# EAGLE schematic signal_distribution_board (EAGLE 9.6.2)
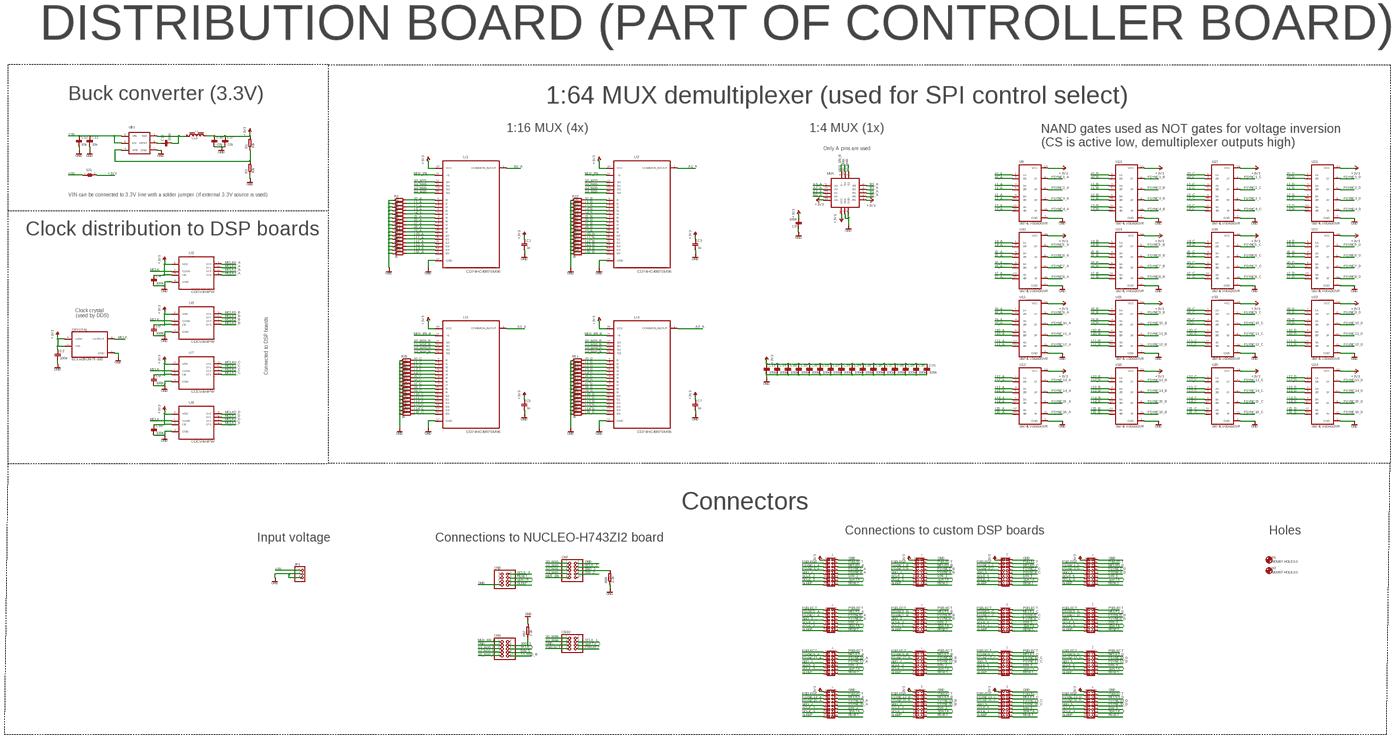
[diagram p0: schematic, sheet 1, overview]
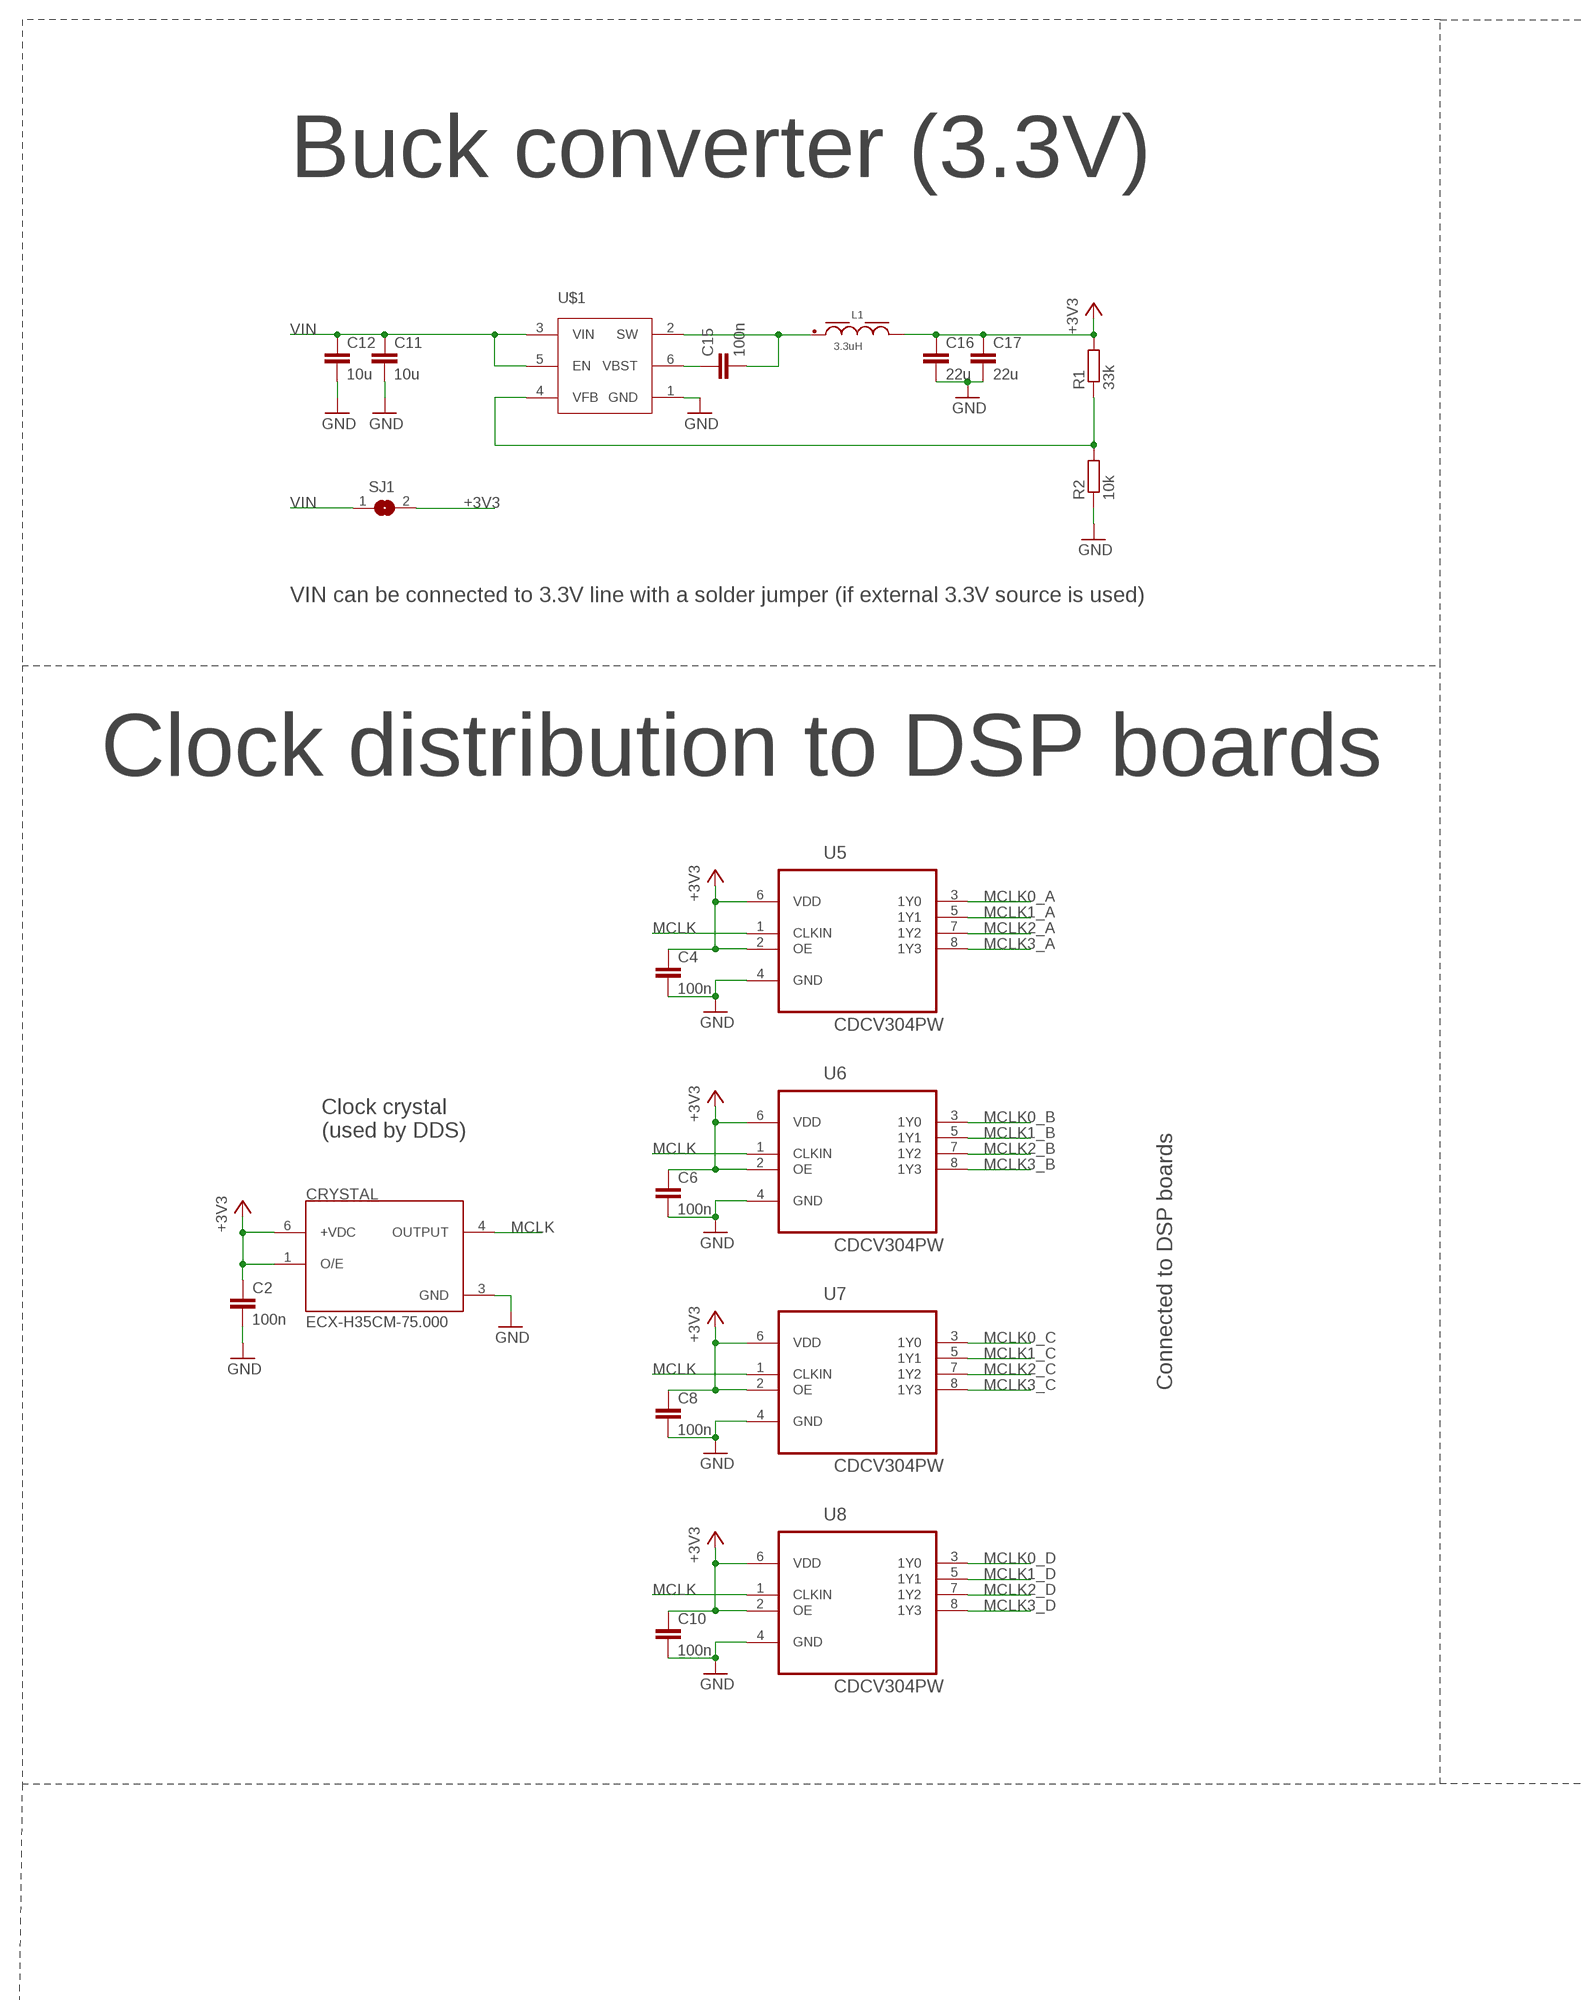
[diagram p1: schematic, sheet 1, part 1 of 8]
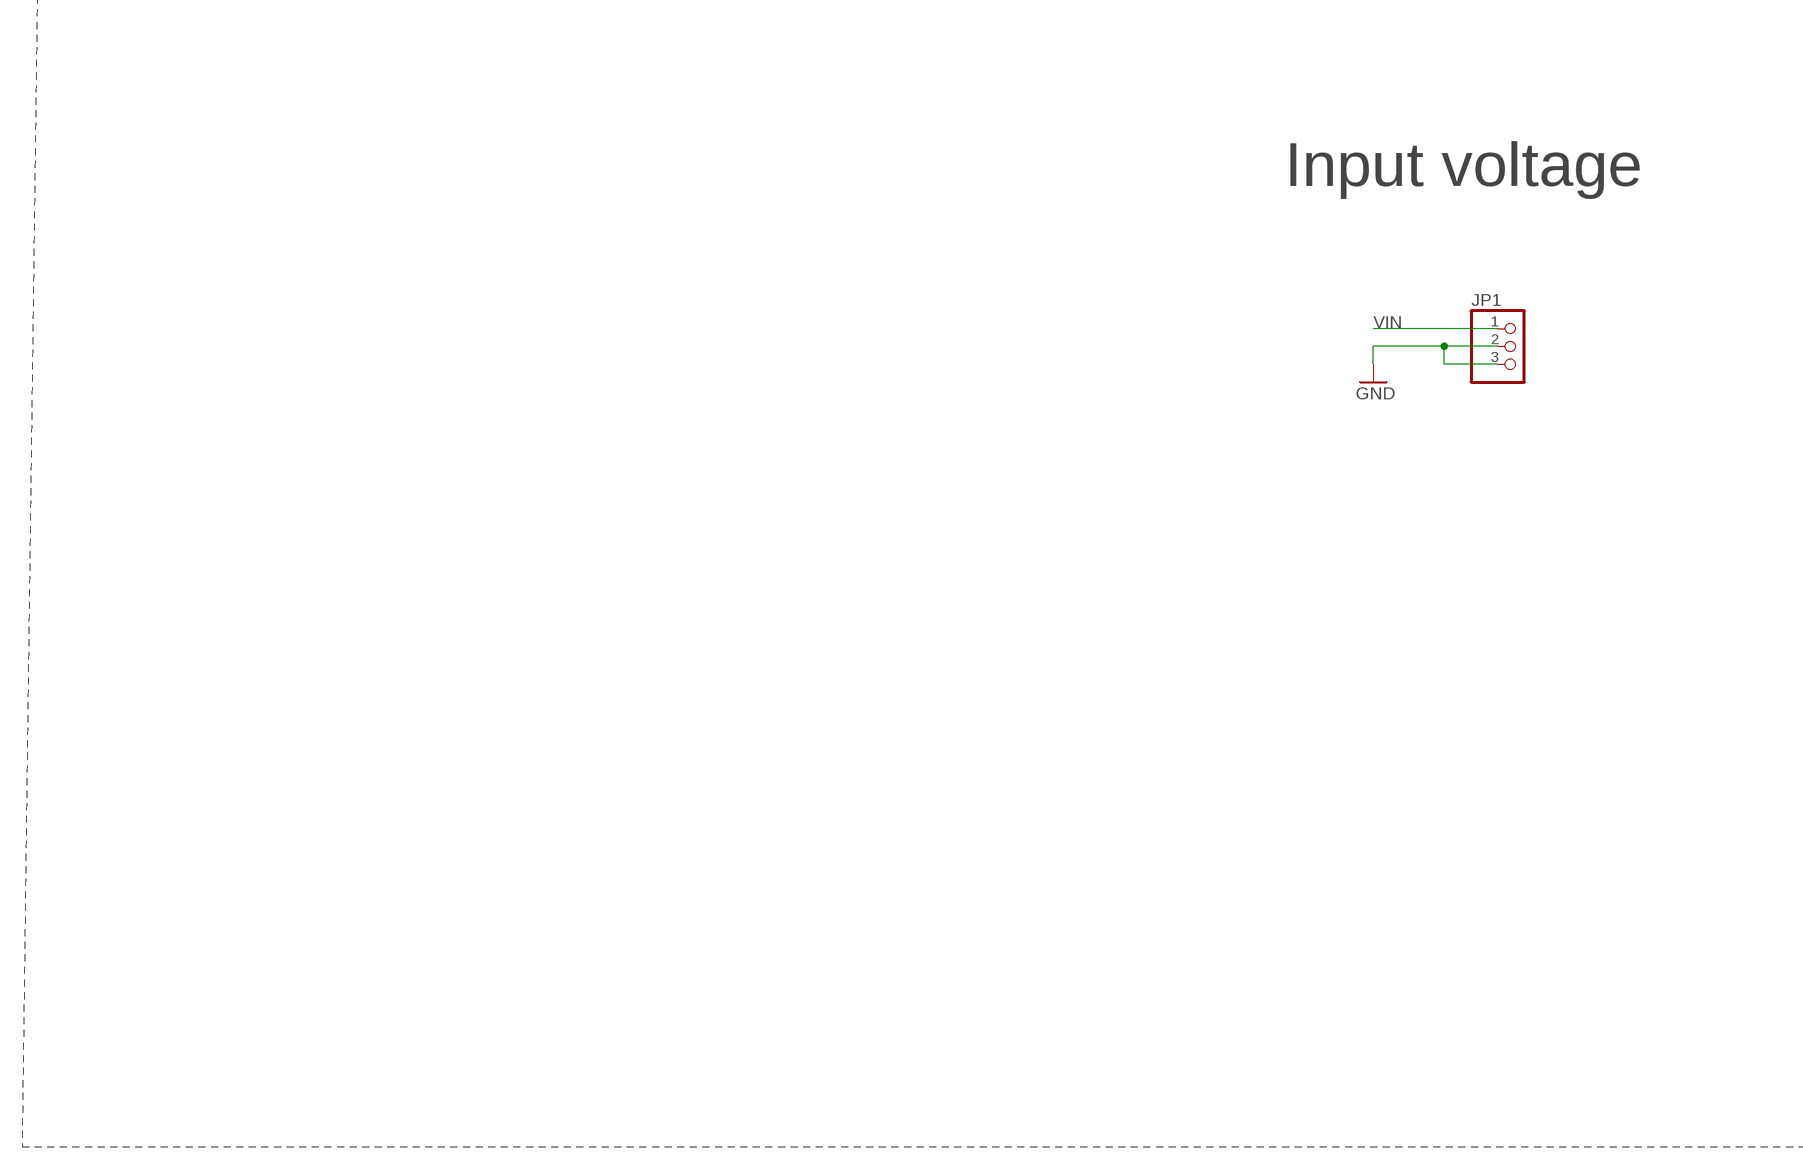
[diagram p2: schematic, sheet 1, part 2 of 8]
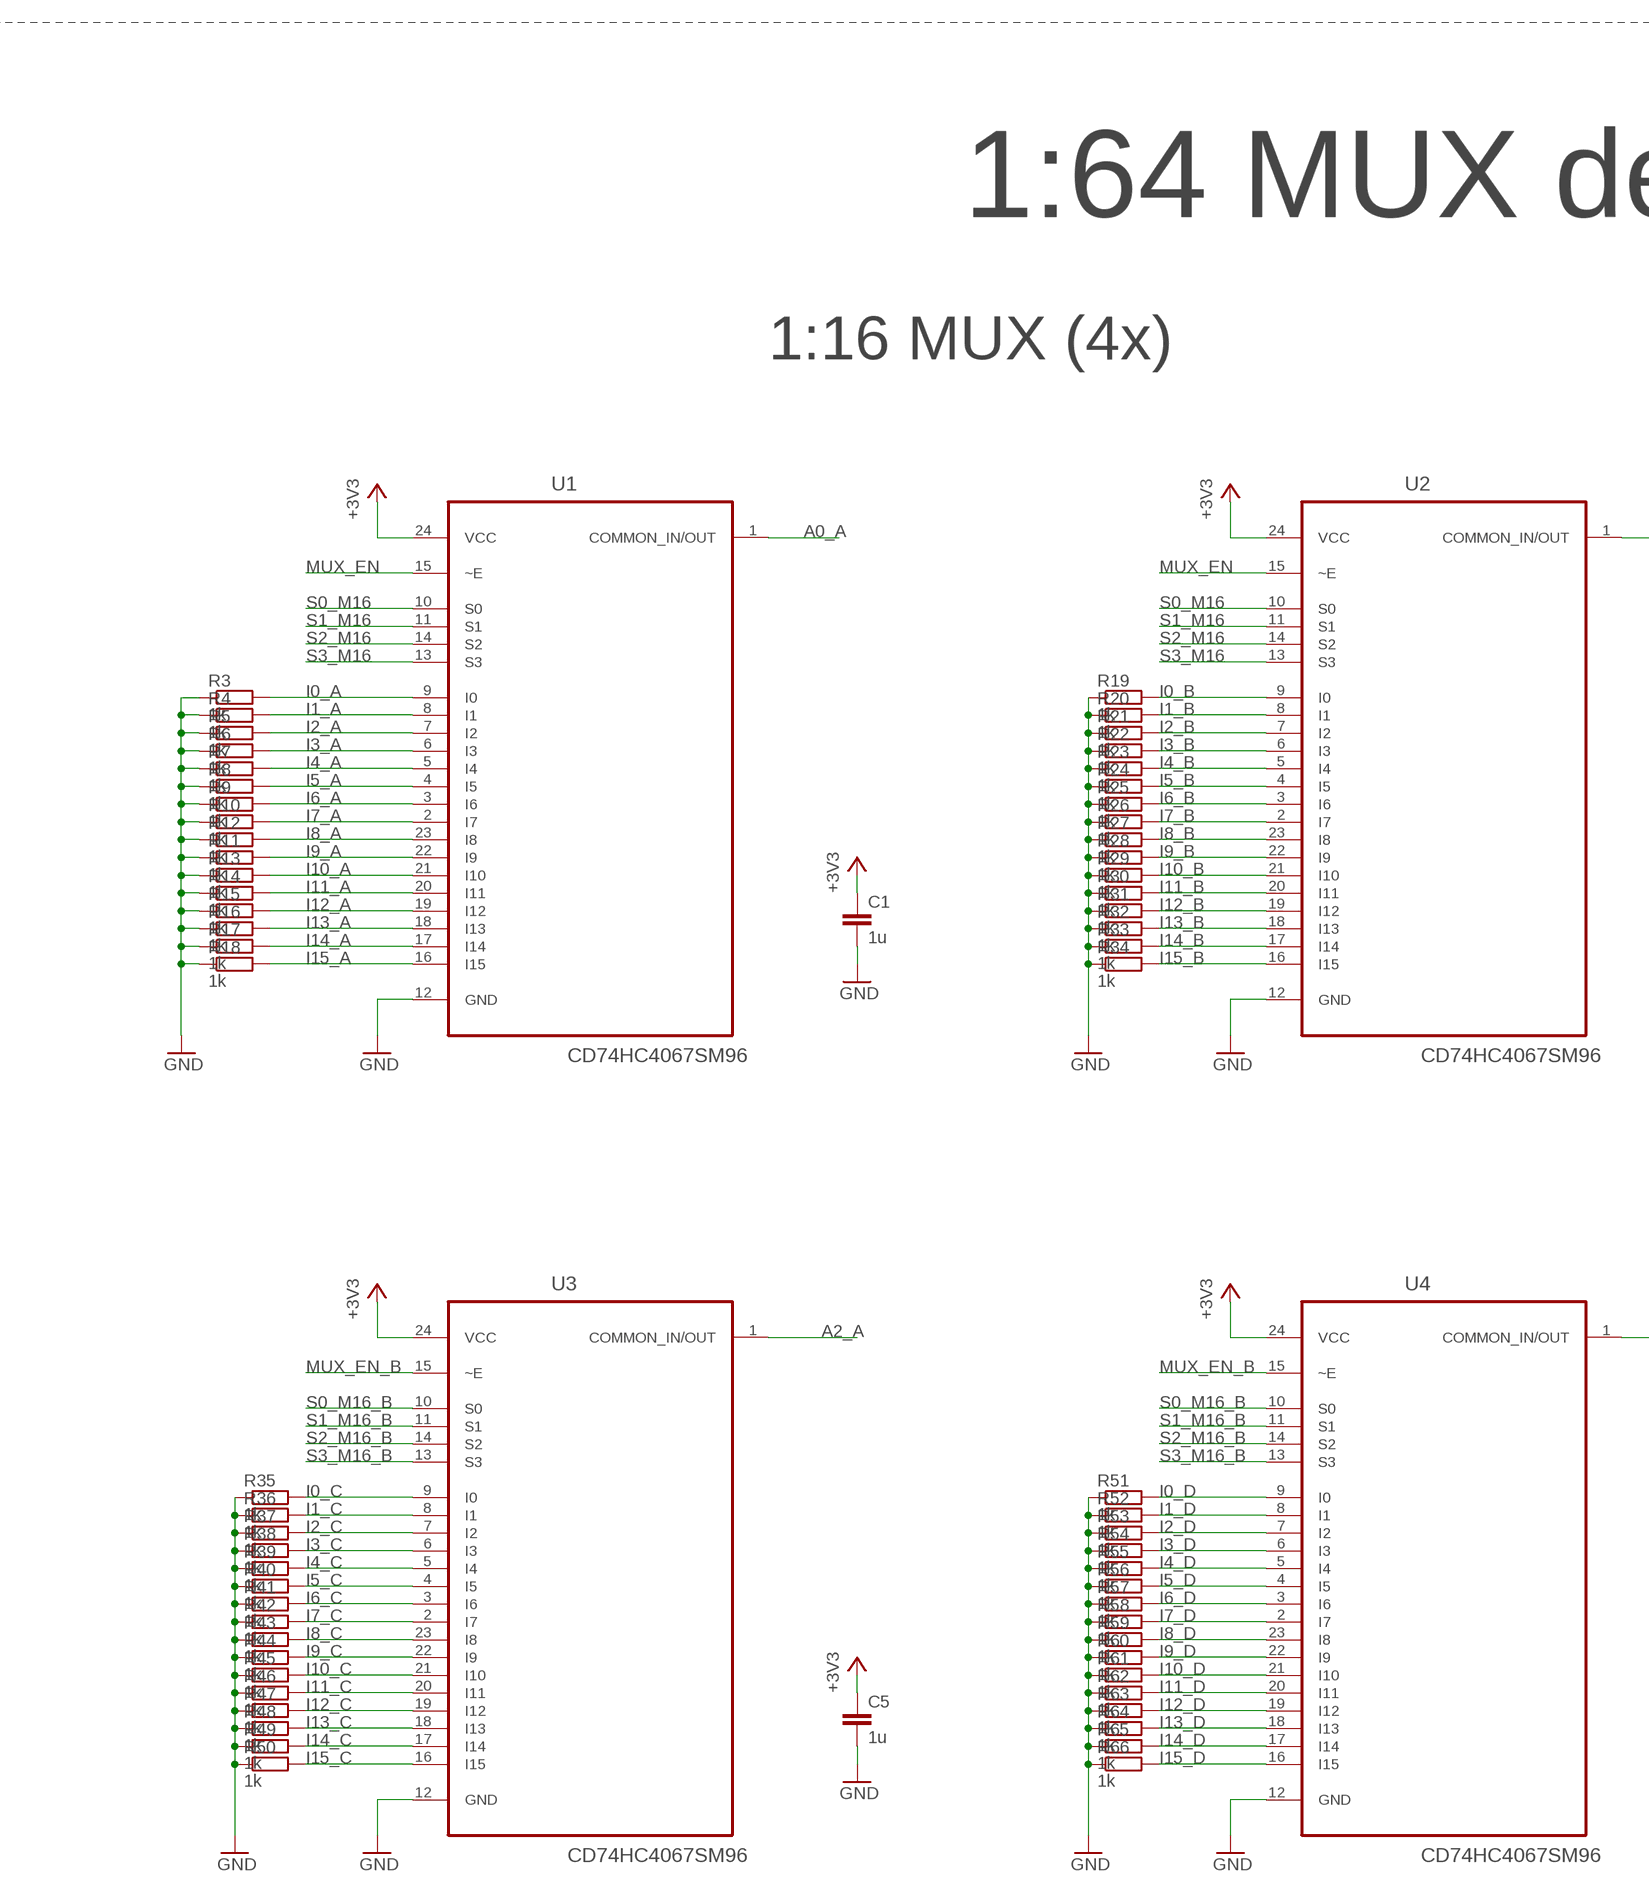
[diagram p3: schematic, sheet 1, part 3 of 8]
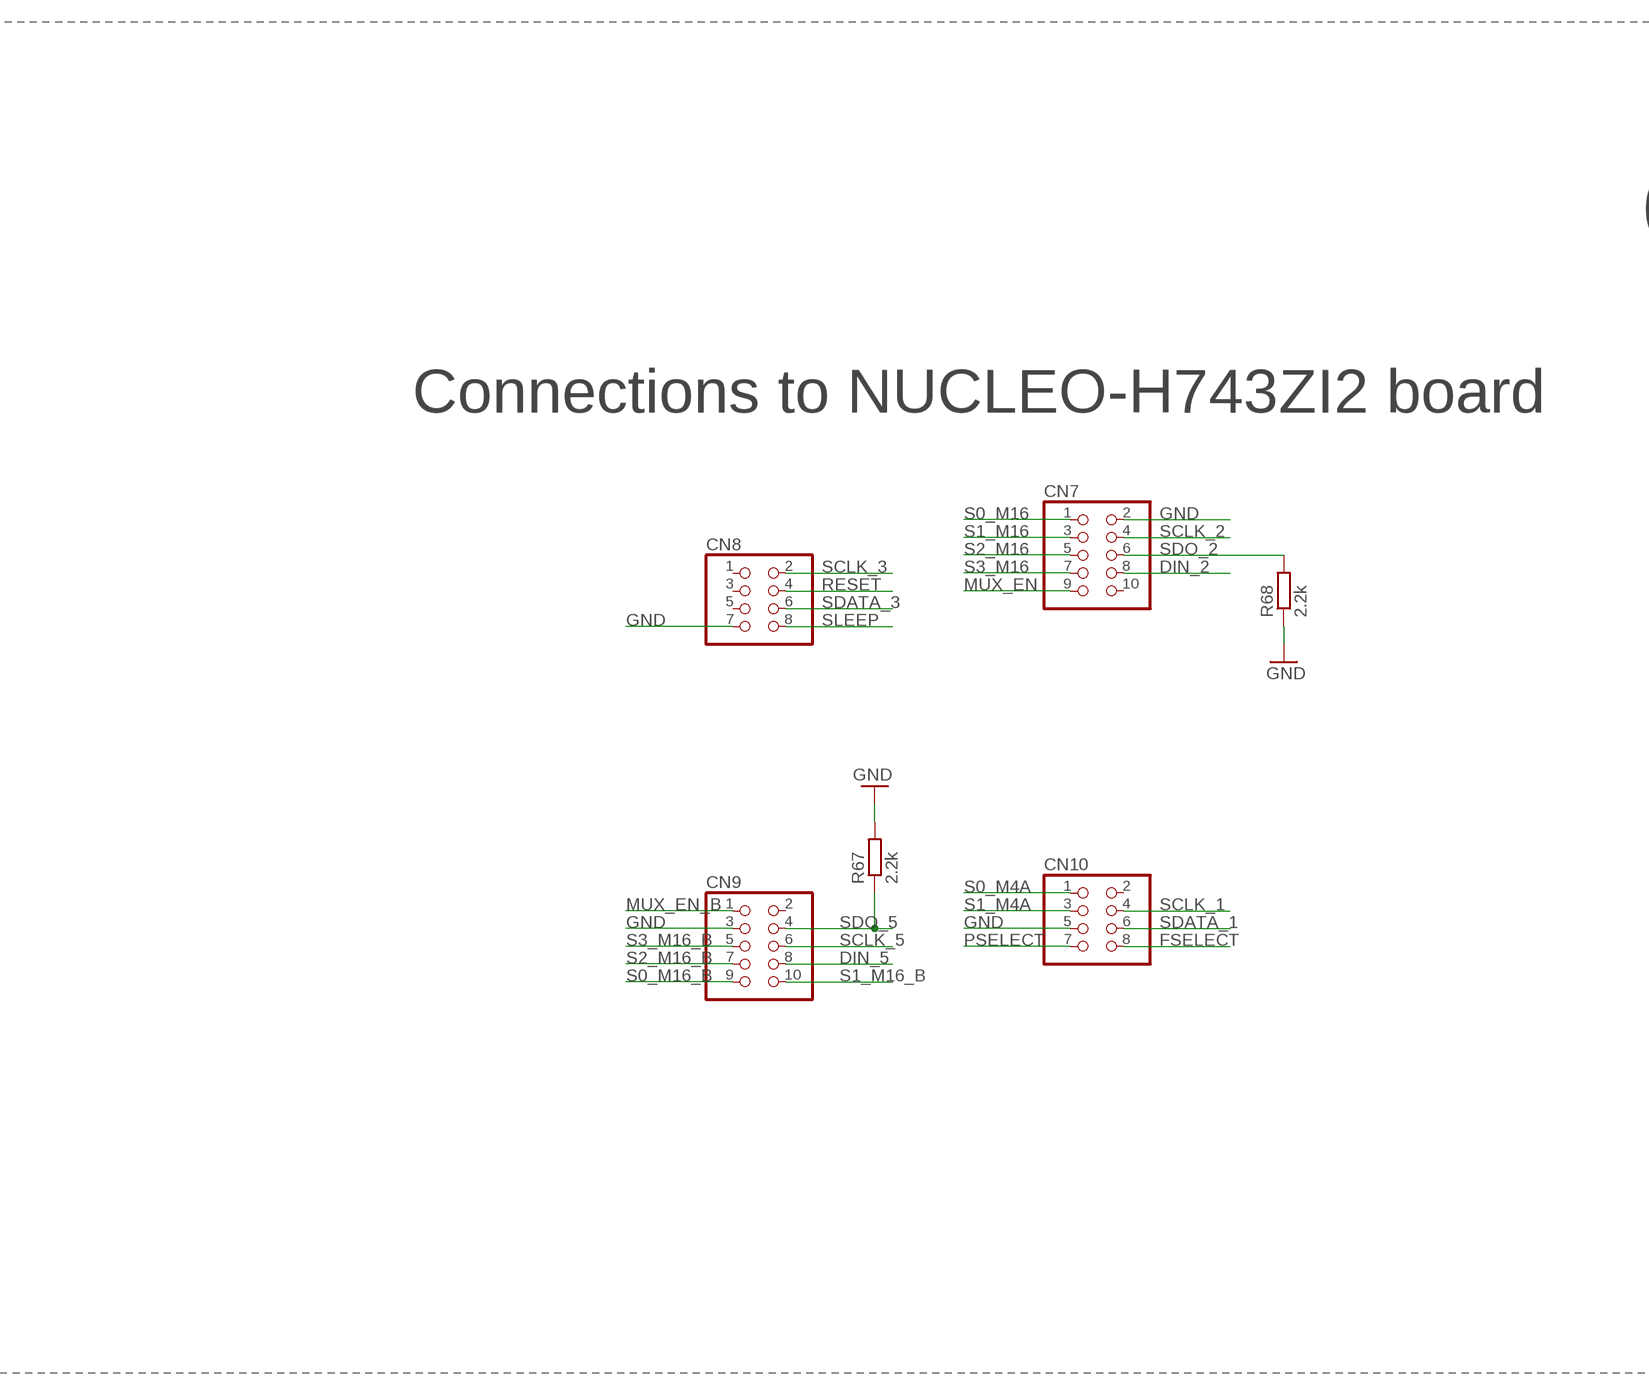
[diagram p4: schematic, sheet 1, part 4 of 8]
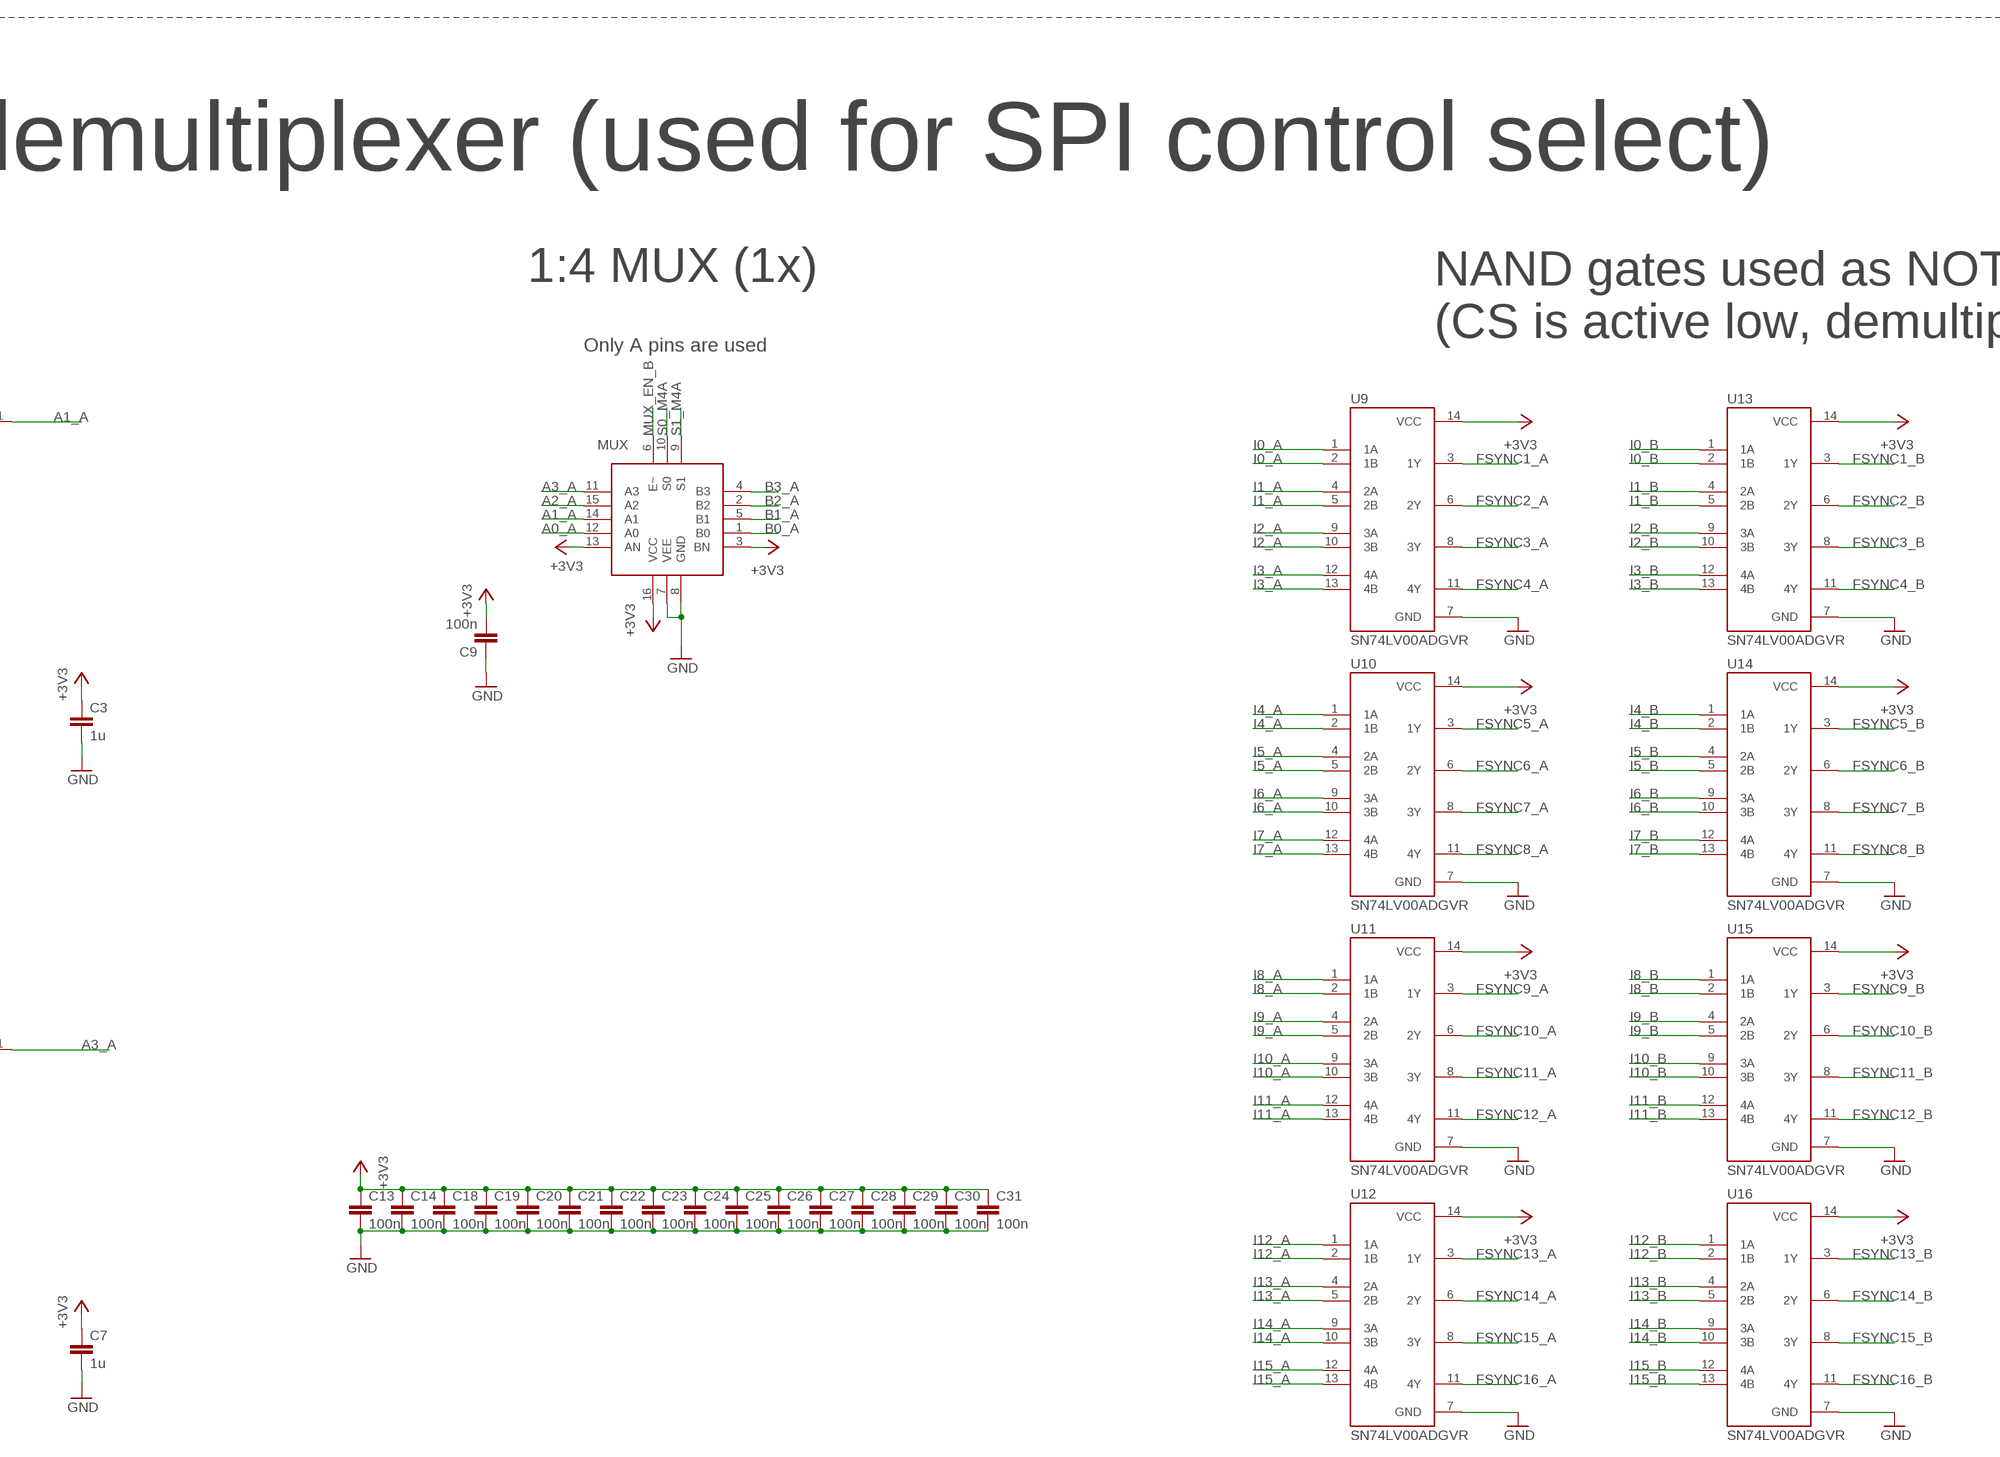
[diagram p5: schematic, sheet 1, part 5 of 8]
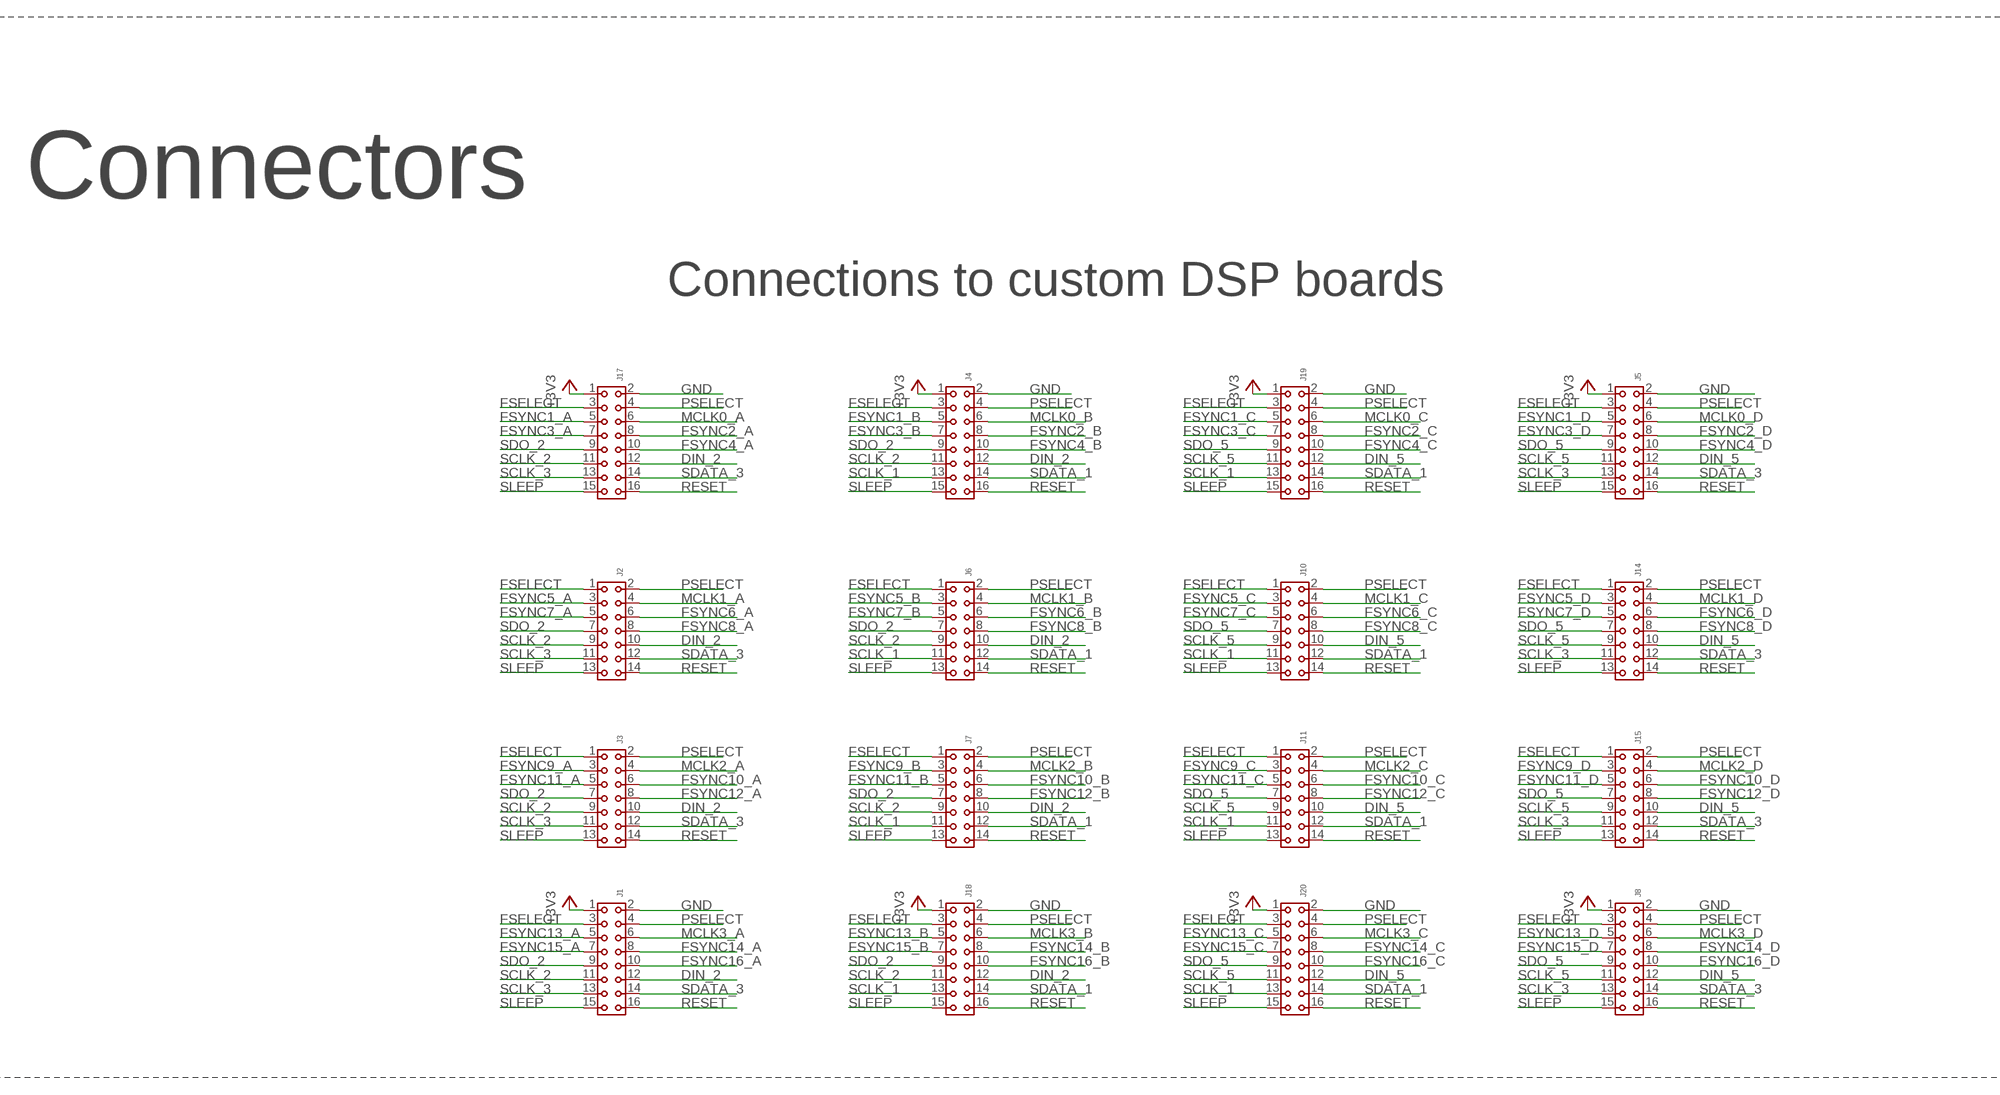
[diagram p6: schematic, sheet 1, part 6 of 8]
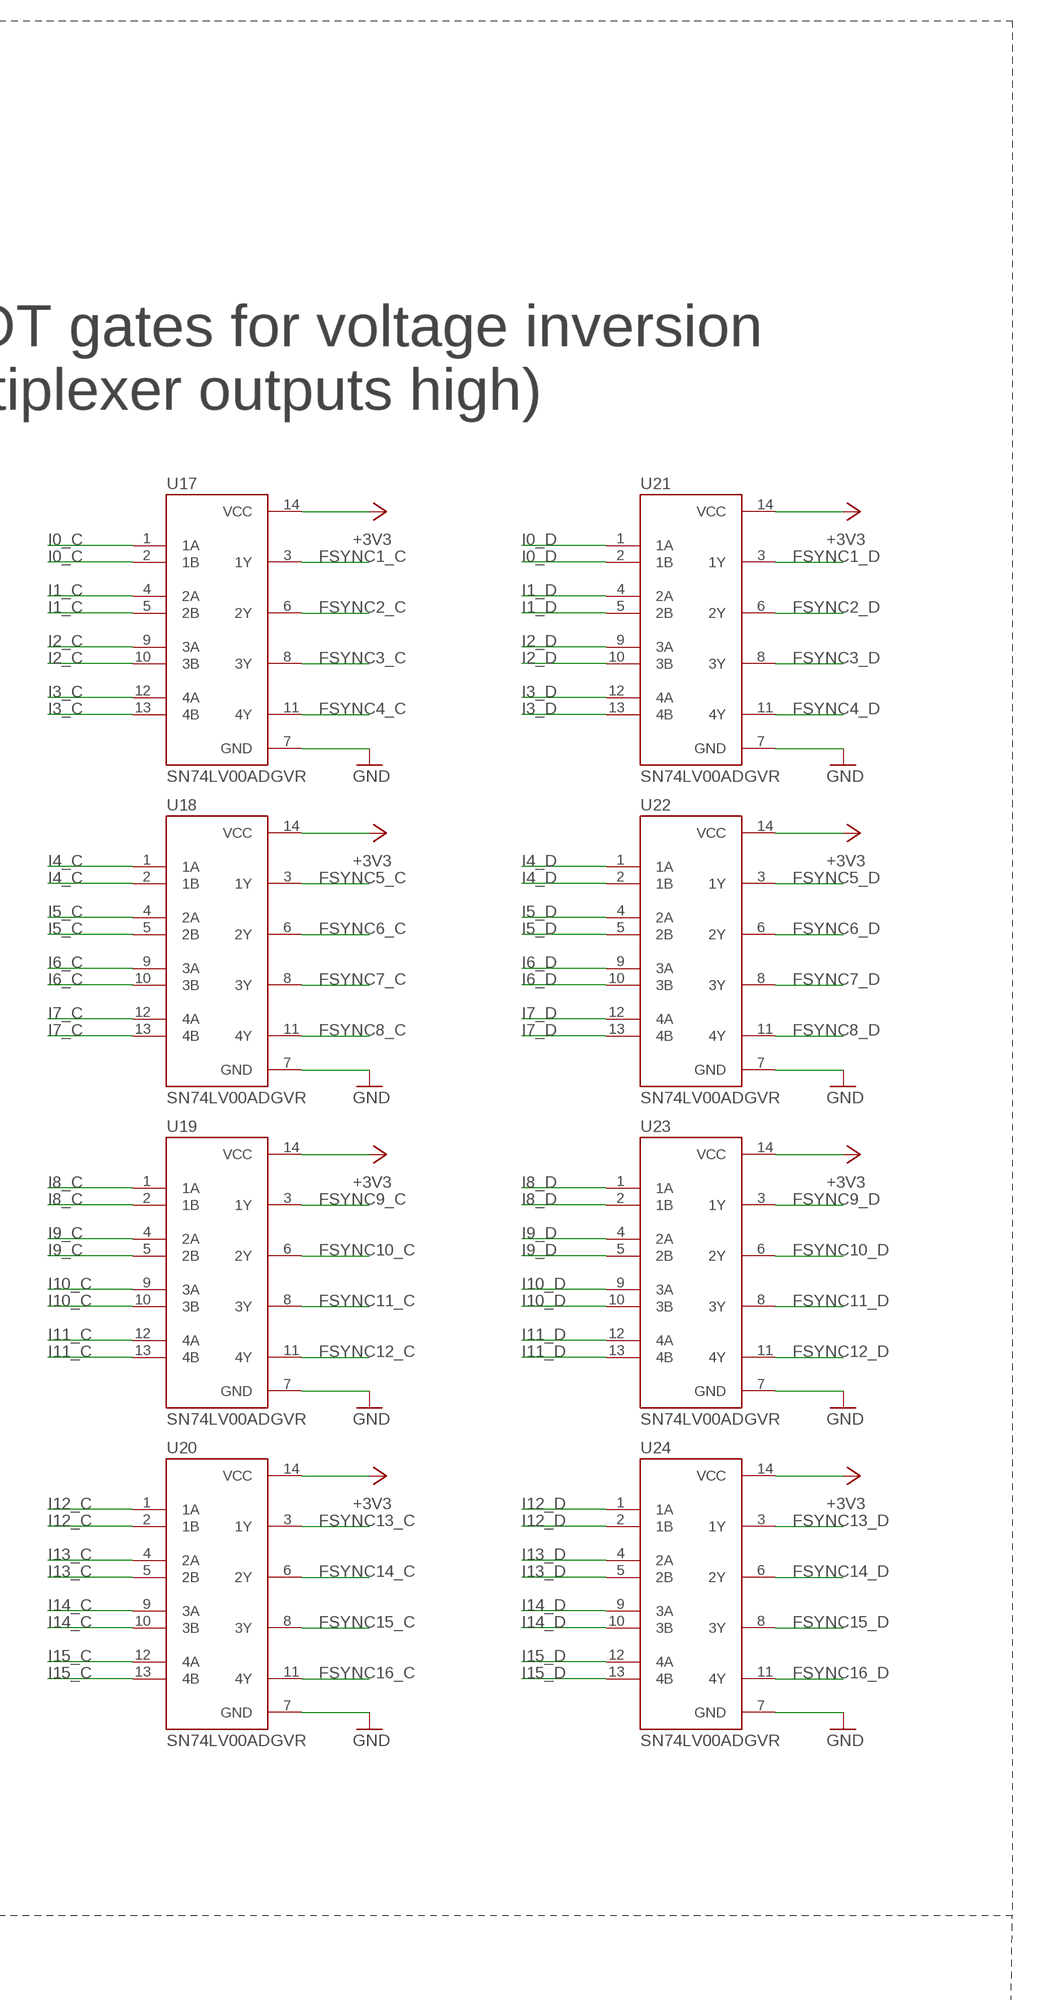
[diagram p7: schematic, sheet 1, part 7 of 8]
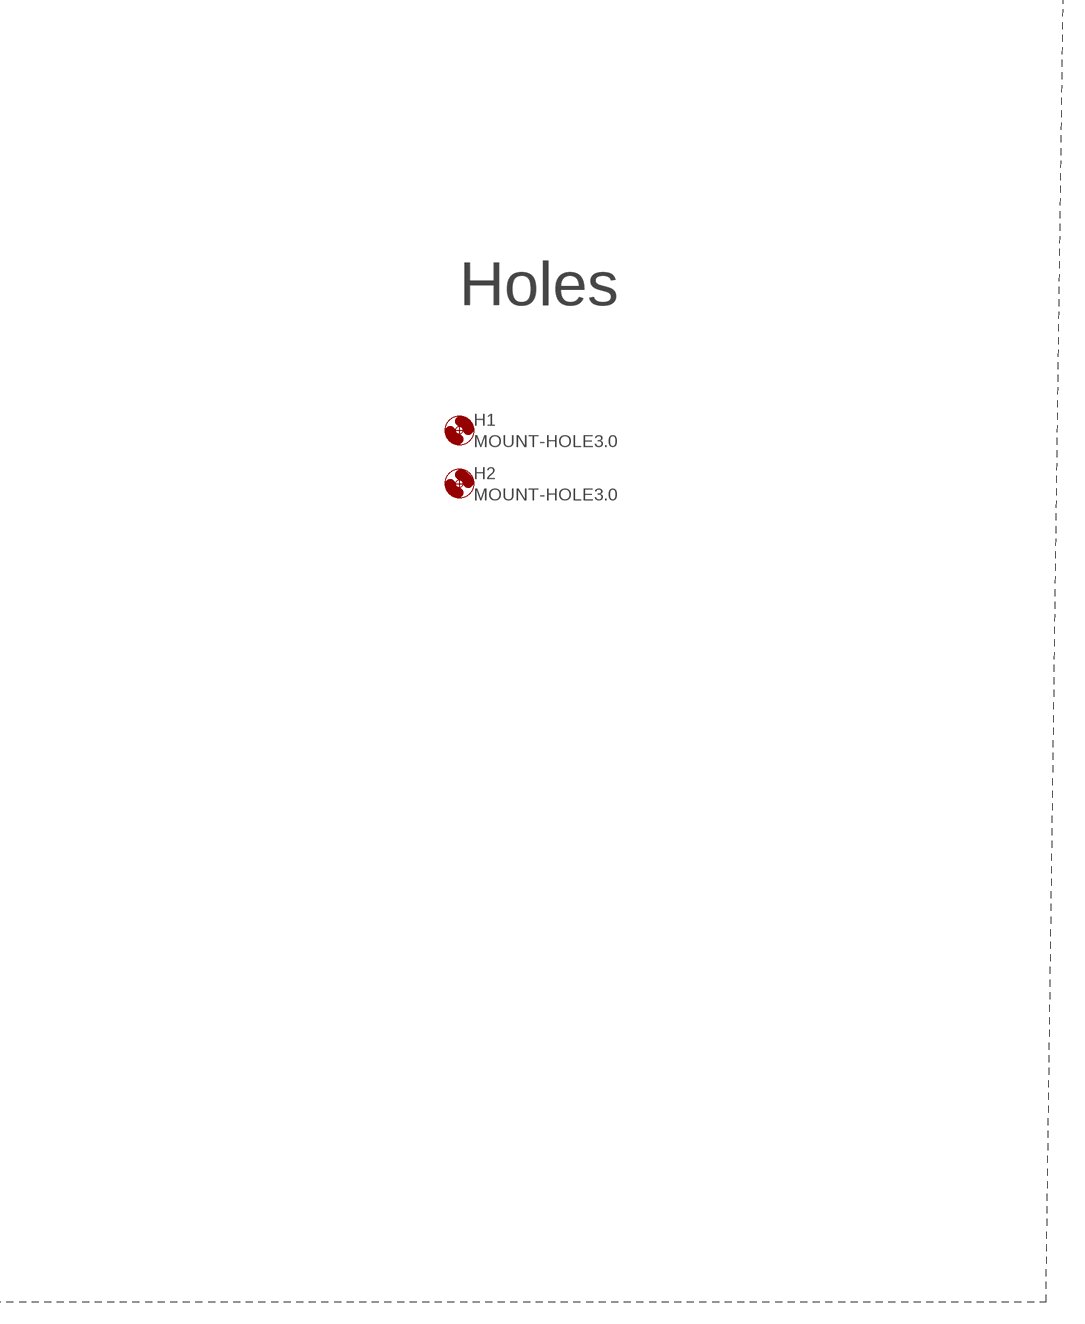
[diagram p8: schematic, sheet 1, part 8 of 8]

## Parts
C1  1u  C-EUC0603  [C0603]
C2  100n  C-EUC0603  [C0603]
C3  1u  C-EUC0603  [C0603]
C4  100n  C-EUC0603  [C0603]
C5  1u  C-EUC0603  [C0603]
C6  100n  C-EUC0603  [C0603]
C7  1u  C-EUC0603  [C0603]
C8  100n  C-EUC0603  [C0603]
C9  100n  C-EUC0603  [C0603]
C10  100n  C-EUC0603  [C0603]
C11  10u  C-EUC0805  [C0805]
C12  10u  C-EUC0805  [C0805]
C13  100n  C-EUC0603  [C0603]
C14  100n  C-EUC0603  [C0603]
C15  100n  C-EUC0603  [C0603]
C16  22u  C-EUC1206  [C1206]
C17  22u  C-EUC1206  [C1206]
C18  100n  C-EUC0603  [C0603]
C19  100n  C-EUC0603  [C0603]
C20  100n  C-EUC0603  [C0603]
C21  100n  C-EUC0603  [C0603]
C22  100n  C-EUC0603  [C0603]
C23  100n  C-EUC0603  [C0603]
C24  100n  C-EUC0603  [C0603]
C25  100n  C-EUC0603  [C0603]
C26  100n  C-EUC0603  [C0603]
C27  100n  C-EUC0603  [C0603]
C28  100n  C-EUC0603  [C0603]
C29  100n  C-EUC0603  [C0603]
C30  100n  C-EUC0603  [C0603]
C31  100n  C-EUC0603  [C0603]
CN7  PINHD-2X5  [2X05]
CN8  PINHD-2X4  [2X04]
CN9  PINHD-2X5  [2X05]
CN10  PINHD-2X4  [2X04]
CRYSTAL  ECX-H35CM-75.000  [OSC_ECX-H35CM-75.000]
H1  MOUNT-HOLE3.0  [3,0]
H2  MOUNT-HOLE3.0  [3,0]
J1  6130XX243121_613016243121  [613016243121]
J2  6130XX243121_613014243121  [613014243121]
J3  6130XX243121_613014243121  [613014243121]
J4  6130XX243121_613016243121  [613016243121]
J5  6130XX243121_613016243121  [613016243121]
J6  6130XX243121_613014243121  [613014243121]
J7  6130XX243121_613014243121  [613014243121]
J8  6130XX243121_613016243121  [613016243121]
J10  6130XX243121_613014243121  [613014243121]
J11  6130XX243121_613014243121  [613014243121]
J14  6130XX243121_613014243121  [613014243121]
J15  6130XX243121_613014243121  [613014243121]
J17  6130XX243121_613016243121  [613016243121]
J18  6130XX243121_613016243121  [613016243121]
J19  6130XX243121_613016243121  [613016243121]
J20  6130XX243121_613016243121  [613016243121]
JP1  PINHD-1X3  [1X03]
L1  3.3uH  WE-PD_7345P_7447773033  [WE-PD_7345P]
MUX  CD74HC4052M96  [SOIC127P600X175-16N]
R1  33k  R-EU_R0603  [R0603]
R2  10k  R-EU_R0603  [R0603]
R3  1k  R-EU_R0603  [R0603]
R4  1k  R-EU_R0603  [R0603]
R5  1k  R-EU_R0603  [R0603]
R6  1k  R-EU_R0603  [R0603]
R7  1k  R-EU_R0603  [R0603]
R8  1k  R-EU_R0603  [R0603]
R9  1k  R-EU_R0603  [R0603]
R10  1k  R-EU_R0603  [R0603]
R11  1k  R-EU_R0603  [R0603]
R12  1k  R-EU_R0603  [R0603]
R13  1k  R-EU_R0603  [R0603]
R14  1k  R-EU_R0603  [R0603]
R15  1k  R-EU_R0603  [R0603]
R16  1k  R-EU_R0603  [R0603]
R17  1k  R-EU_R0603  [R0603]
R18  1k  R-EU_R0603  [R0603]
R19  1k  R-EU_R0603  [R0603]
R20  1k  R-EU_R0603  [R0603]
R21  1k  R-EU_R0603  [R0603]
R22  1k  R-EU_R0603  [R0603]
R23  1k  R-EU_R0603  [R0603]
R24  1k  R-EU_R0603  [R0603]
R25  1k  R-EU_R0603  [R0603]
R26  1k  R-EU_R0603  [R0603]
R27  1k  R-EU_R0603  [R0603]
R28  1k  R-EU_R0603  [R0603]
R29  1k  R-EU_R0603  [R0603]
R30  1k  R-EU_R0603  [R0603]
R31  1k  R-EU_R0603  [R0603]
R32  1k  R-EU_R0603  [R0603]
R33  1k  R-EU_R0603  [R0603]
R34  1k  R-EU_R0603  [R0603]
R35  1k  R-EU_R0603  [R0603]
R36  1k  R-EU_R0603  [R0603]
R37  1k  R-EU_R0603  [R0603]
R38  1k  R-EU_R0603  [R0603]
R39  1k  R-EU_R0603  [R0603]
R40  1k  R-EU_R0603  [R0603]
R41  1k  R-EU_R0603  [R0603]
R42  1k  R-EU_R0603  [R0603]
R43  1k  R-EU_R0603  [R0603]
R44  1k  R-EU_R0603  [R0603]
R45  1k  R-EU_R0603  [R0603]
R46  1k  R-EU_R0603  [R0603]
R47  1k  R-EU_R0603  [R0603]
R48  1k  R-EU_R0603  [R0603]
R49  1k  R-EU_R0603  [R0603]
R50  1k  R-EU_R0603  [R0603]
R51  1k  R-EU_R0603  [R0603]
R52  1k  R-EU_R0603  [R0603]
R53  1k  R-EU_R0603  [R0603]
R54  1k  R-EU_R0603  [R0603]
R55  1k  R-EU_R0603  [R0603]
R56  1k  R-EU_R0603  [R0603]
R57  1k  R-EU_R0603  [R0603]
R58  1k  R-EU_R0603  [R0603]
R59  1k  R-EU_R0603  [R0603]
R60  1k  R-EU_R0603  [R0603]
R61  1k  R-EU_R0603  [R0603]
R62  1k  R-EU_R0603  [R0603]
R63  1k  R-EU_R0603  [R0603]
R64  1k  R-EU_R0603  [R0603]
R65  1k  R-EU_R0603  [R0603]
R66  1k  R-EU_R0603  [R0603]
R67  2.2k  R-EU_R0805  [R0805]
R68  2.2k  R-EU_R0805  [R0805]
SJ1  SJ  [SJ]
U1  CD74HC4067SM96  [SOP65P780X200-24N]
U2  CD74HC4067SM96  [SOP65P780X200-24N]
U3  CD74HC4067SM96  [SOP65P780X200-24N]
U4  CD74HC4067SM96  [SOP65P780X200-24N]
U5  CDCV304PW  [SOP65P640X120-8N]
U6  CDCV304PW  [SOP65P640X120-8N]
U7  CDCV304PW  [SOP65P640X120-8N]
U8  CDCV304PW  [SOP65P640X120-8N]
U9  SN74LV00ADGVR  [SOP40P640X120-14N]
U10  SN74LV00ADGVR  [SOP40P640X120-14N]
U11  SN74LV00ADGVR  [SOP40P640X120-14N]
U12  SN74LV00ADGVR  [SOP40P640X120-14N]
U13  SN74LV00ADGVR  [SOP40P640X120-14N]
U14  SN74LV00ADGVR  [SOP40P640X120-14N]
U15  SN74LV00ADGVR  [SOP40P640X120-14N]
U16  SN74LV00ADGVR  [SOP40P640X120-14N]
U17  SN74LV00ADGVR  [SOP40P640X120-14N]
U18  SN74LV00ADGVR  [SOP40P640X120-14N]
U19  SN74LV00ADGVR  [SOP40P640X120-14N]
U20  SN74LV00ADGVR  [SOP40P640X120-14N]
U21  SN74LV00ADGVR  [SOP40P640X120-14N]
U22  SN74LV00ADGVR  [SOP40P640X120-14N]
U23  SN74LV00ADGVR  [SOP40P640X120-14N]
U24  SN74LV00ADGVR  [SOP40P640X120-14N]
U$1  TPS562209  [SOT95P280X110-6N]

## Nets
+3V3: C1.1 C2.1 C3.1 C4.1 C5.1 C6.1 C7.1 C8.1 C9.2 C10.1 C13.1 C14.1 C16.1 C17.1 C18.1 C19.1 C20.1 C21.1 C22.1 C23.1 C24.1 C25.1 C26.1 C27.1 C28.1 C29.1 C30.1 C31.1 CRYSTAL.1(O/E) CRYSTAL.6(+VDC) J1.1 J4.1 J5.1 J8.1 J17.1 J18.1 J19.1 J20.1 L1.2 MUX.3(BN) MUX.13(AN) MUX.16(VCC) R1.2 SJ1.2 U1.24(VCC) U2.24(VCC) U3.24(VCC) U4.24(VCC) U5.2(OE) U5.6(VDD) U6.2(OE) U6.6(VDD) U7.2(OE) U7.6(VDD) U8.2(OE) U8.6(VDD) U9.14(VCC) U10.14(VCC) U11.14(VCC) U12.14(VCC) U13.14(VCC) U14.14(VCC) U15.14(VCC) U16.14(VCC) U17.14(VCC) U18.14(VCC) U19.14(VCC) U20.14(VCC) U21.14(VCC) U22.14(VCC) U23.14(VCC) U24.14(VCC)
A0_A: MUX.12(A0) U1.1(COMMON_IN/OUT)
A1_A: MUX.14(A1) U2.1(COMMON_IN/OUT)
A2_A: MUX.15(A2) U3.1(COMMON_IN/OUT)
A3_A: MUX.11(A3) U4.1(COMMON_IN/OUT)
B0_A: MUX.1(B0)
B1_A: MUX.5(B1)
B2_A: MUX.2(B2)
B3_A: MUX.4(B3)
DIN_2: CN7.8 J1.12 J2.10 J3.10 J4.12 J6.10 J7.10 J17.12 J18.12
DIN_5: CN9.8 J5.12 J8.12 J10.10 J11.10 J14.10 J15.10 J19.12 J20.12
FSELECT: CN10.8 J1.3 J2.1 J3.1 J4.3 J5.3 J6.1 J7.1 J8.3 J10.1 J11.1 J14.1 J15.1 J17.3 J18.3 J19.3 J20.3
FSYNC1_A: J17.5 U9.3(1Y)
FSYNC1_B: J4.5 U13.3(1Y)
FSYNC1_C: J19.5 U17.3(1Y)
FSYNC1_D: J5.5 U21.3(1Y)
FSYNC2_A: J17.8 U9.6(2Y)
FSYNC2_B: J4.8 U13.6(2Y)
FSYNC2_C: J19.8 U17.6(2Y)
FSYNC2_D: J5.8 U21.6(2Y)
FSYNC3_A: J17.7 U9.8(3Y)
FSYNC3_B: J4.7 U13.8(3Y)
FSYNC3_C: J19.7 U17.8(3Y)
FSYNC3_D: J5.7 U21.8(3Y)
FSYNC4_A: J17.10 U9.11(4Y)
FSYNC4_B: J4.10 U13.11(4Y)
FSYNC4_C: J19.10 U17.11(4Y)
FSYNC4_D: J5.10 U21.11(4Y)
FSYNC5_A: J2.3 U10.3(1Y)
FSYNC5_B: J6.3 U14.3(1Y)
FSYNC5_C: J10.3 U18.3(1Y)
FSYNC5_D: J14.3 U22.3(1Y)
FSYNC6_A: J2.6 U10.6(2Y)
FSYNC6_B: J6.6 U14.6(2Y)
FSYNC6_C: J10.6 U18.6(2Y)
FSYNC6_D: J14.6 U22.6(2Y)
FSYNC7_A: J2.5 U10.8(3Y)
FSYNC7_B: J6.5 U14.8(3Y)
FSYNC7_C: J10.5 U18.8(3Y)
FSYNC7_D: J14.5 U22.8(3Y)
FSYNC8_A: J2.8 U10.11(4Y)
FSYNC8_B: J6.8 U14.11(4Y)
FSYNC8_C: J10.8 U18.11(4Y)
FSYNC8_D: J14.8 U22.11(4Y)
FSYNC9_A: J3.3 U11.3(1Y)
FSYNC9_B: J7.3 U15.3(1Y)
FSYNC9_C: J11.3 U19.3(1Y)
FSYNC9_D: J15.3 U23.3(1Y)
FSYNC10_A: J3.6 U11.6(2Y)
FSYNC10_B: J7.6 U15.6(2Y)
FSYNC10_C: J11.6 U19.6(2Y)
FSYNC10_D: J15.6 U23.6(2Y)
FSYNC11_A: J3.5 U11.8(3Y)
FSYNC11_B: J7.5 U15.8(3Y)
FSYNC11_C: J11.5 U19.8(3Y)
FSYNC11_D: J15.5 U23.8(3Y)
FSYNC12_A: J3.8 U11.11(4Y)
FSYNC12_B: J7.8 U15.11(4Y)
FSYNC12_C: J11.8 U19.11(4Y)
FSYNC12_D: J15.8 U23.11(4Y)
FSYNC13_A: J1.5 U12.3(1Y)
FSYNC13_B: J18.5 U16.3(1Y)
FSYNC13_C: J20.5 U20.3(1Y)
FSYNC13_D: J8.5 U24.3(1Y)
FSYNC14_A: J1.8 U12.6(2Y)
FSYNC14_B: J18.8 U16.6(2Y)
FSYNC14_C: J20.8 U20.6(2Y)
FSYNC14_D: J8.8 U24.6(2Y)
FSYNC15_A: J1.7 U12.8(3Y)
FSYNC15_B: J18.7 U16.8(3Y)
FSYNC15_C: J20.7 U20.8(3Y)
FSYNC15_D: J8.7 U24.8(3Y)
FSYNC16_A: J1.10 U12.11(4Y)
FSYNC16_B: J18.10 U16.11(4Y)
FSYNC16_C: J20.10 U20.11(4Y)
FSYNC16_D: J8.10 U24.11(4Y)
GND: C1.2 C2.2 C3.2 C4.2 C5.2 C6.2 C7.2 C8.2 C9.1 C10.2 C11.2 C12.2 C13.2 C14.2 C16.2 C17.2 C18.2 C19.2 C20.2 C21.2 C22.2 C23.2 C24.2 C25.2 C26.2 C27.2 C28.2 C29.2 C30.2 C31.2 CN7.2 CN8.7 CN9.3 CN10.5 CRYSTAL.3(GND) J1.2 J4.2 J5.2 J8.2 J17.2 J18.2 J19.2 J20.2 JP1.2 JP1.3 MUX.7(VEE) MUX.8(GND) R2.1 R3.1 R4.1 R5.1 R6.1 R7.1 R8.1 R9.1 R10.1 R11.1 R12.1 R13.1 R14.1 R15.1 R16.1 R17.1 R18.1 R19.1 R20.1 R21.1 R22.1 R23.1 R24.1 R25.1 R26.1 R27.1 R28.1 R29.1 R30.1 R31.1 R32.1 R33.1 R34.1 R35.1 R36.1 R37.1 R38.1 R39.1 R40.1 R41.1 R42.1 R43.1 R44.1 R45.1 R46.1 R47.1 R48.1 R49.1 R50.1 R51.1 R52.1 R53.1 R54.1 R55.1 R56.1 R57.1 R58.1 R59.1 R60.1 R61.1 R62.1 R63.1 R64.1 R65.1 R66.1 R67.2 R68.1 U1.12(GND) U2.12(GND) U3.12(GND) U4.12(GND) U5.4(GND) U6.4(GND) U7.4(GND) U8.4(GND) U9.7(GND) U10.7(GND) U11.7(GND) U12.7(GND) U13.7(GND) U14.7(GND) U15.7(GND) U16.7(GND) U17.7(GND) U18.7(GND) U19.7(GND) U20.7(GND) U21.7(GND) U22.7(GND) U23.7(GND) U24.7(GND) U$1.1(GND)
I0_A: R3.2 U1.9(I0) U9.1(1A) U9.2(1B)
I0_B: R19.2 U2.9(I0) U13.1(1A) U13.2(1B)
I0_C: R35.2 U3.9(I0) U17.1(1A) U17.2(1B)
I0_D: R51.2 U4.9(I0) U21.1(1A) U21.2(1B)
I1_A: R4.2 U1.8(I1) U9.4(2A) U9.5(2B)
I1_B: R20.2 U2.8(I1) U13.4(2A) U13.5(2B)
I1_C: R36.2 U3.8(I1) U17.4(2A) U17.5(2B)
I1_D: R52.2 U4.8(I1) U21.4(2A) U21.5(2B)
I2_A: R5.2 U1.7(I2) U9.9(3A) U9.10(3B)
I2_B: R21.2 U2.7(I2) U13.9(3A) U13.10(3B)
I2_C: R37.2 U3.7(I2) U17.9(3A) U17.10(3B)
I2_D: R53.2 U4.7(I2) U21.9(3A) U21.10(3B)
I3_A: R6.2 U1.6(I3) U9.12(4A) U9.13(4B)
I3_B: R22.2 U2.6(I3) U13.12(4A) U13.13(4B)
I3_C: R38.2 U3.6(I3) U17.12(4A) U17.13(4B)
I3_D: R54.2 U4.6(I3) U21.12(4A) U21.13(4B)
I4_A: R7.2 U1.5(I4) U10.1(1A) U10.2(1B)
I4_B: R23.2 U2.5(I4) U14.1(1A) U14.2(1B)
I4_C: R39.2 U3.5(I4) U18.1(1A) U18.2(1B)
I4_D: R55.2 U4.5(I4) U22.1(1A) U22.2(1B)
I5_A: R8.2 U1.4(I5) U10.4(2A) U10.5(2B)
I5_B: R24.2 U2.4(I5) U14.4(2A) U14.5(2B)
I5_C: R40.2 U3.4(I5) U18.4(2A) U18.5(2B)
I5_D: R56.2 U4.4(I5) U22.4(2A) U22.5(2B)
I6_A: R9.2 U1.3(I6) U10.9(3A) U10.10(3B)
I6_B: R25.2 U2.3(I6) U14.9(3A) U14.10(3B)
I6_C: R41.2 U3.3(I6) U18.9(3A) U18.10(3B)
I6_D: R57.2 U4.3(I6) U22.9(3A) U22.10(3B)
I7_A: R10.2 U1.2(I7) U10.12(4A) U10.13(4B)
I7_B: R26.2 U2.2(I7) U14.12(4A) U14.13(4B)
I7_C: R42.2 U3.2(I7) U18.12(4A) U18.13(4B)
I7_D: R58.2 U4.2(I7) U22.12(4A) U22.13(4B)
I8_A: R12.2 U1.23(I8) U11.1(1A) U11.2(1B)
I8_B: R27.2 U2.23(I8) U15.1(1A) U15.2(1B)
I8_C: R43.2 U3.23(I8) U19.1(1A) U19.2(1B)
I8_D: R59.2 U4.23(I8) U23.1(1A) U23.2(1B)
I9_A: R11.2 U1.22(I9) U11.4(2A) U11.5(2B)
I9_B: R28.2 U2.22(I9) U15.4(2A) U15.5(2B)
I9_C: R44.2 U3.22(I9) U19.4(2A) U19.5(2B)
I9_D: R60.2 U4.22(I9) U23.4(2A) U23.5(2B)
I10_A: R13.2 U1.21(I10) U11.9(3A) U11.10(3B)
I10_B: R29.2 U2.21(I10) U15.9(3A) U15.10(3B)
I10_C: R45.2 U3.21(I10) U19.9(3A) U19.10(3B)
I10_D: R61.2 U4.21(I10) U23.9(3A) U23.10(3B)
I11_A: R14.2 U1.20(I11) U11.12(4A) U11.13(4B)
I11_B: R30.2 U2.20(I11) U15.12(4A) U15.13(4B)
I11_C: R46.2 U3.20(I11) U19.12(4A) U19.13(4B)
I11_D: R62.2 U4.20(I11) U23.12(4A) U23.13(4B)
I12_A: R15.2 U1.19(I12) U12.1(1A) U12.2(1B)
I12_B: R31.2 U2.19(I12) U16.1(1A) U16.2(1B)
I12_C: R47.2 U3.19(I12) U20.1(1A) U20.2(1B)
I12_D: R63.2 U4.19(I12) U24.1(1A) U24.2(1B)
I13_A: R16.2 U1.18(I13) U12.4(2A) U12.5(2B)
I13_B: R32.2 U2.18(I13) U16.4(2A) U16.5(2B)
I13_C: R48.2 U3.18(I13) U20.4(2A) U20.5(2B)
I13_D: R64.2 U4.18(I13) U24.4(2A) U24.5(2B)
I14_A: R17.2 U1.17(I14) U12.9(3A) U12.10(3B)
I14_B: R33.2 U2.17(I14) U16.9(3A) U16.10(3B)
I14_C: R49.2 U3.17(I14) U20.9(3A) U20.10(3B)
I14_D: R65.2 U4.17(I14) U24.9(3A) U24.10(3B)
I15_A: R18.2 U1.16(I15) U12.12(4A) U12.13(4B)
I15_B: R34.2 U2.16(I15) U16.12(4A) U16.13(4B)
I15_C: R50.2 U3.16(I15) U20.12(4A) U20.13(4B)
I15_D: R66.2 U4.16(I15) U24.12(4A) U24.13(4B)
MCLK: CRYSTAL.4(OUTPUT) U5.1(CLKIN) U6.1(CLKIN) U7.1(CLKIN) U8.1(CLKIN)
MCLK0_A: J17.6 U5.3(1Y0)
MCLK0_B: J4.6 U6.3(1Y0)
MCLK0_C: J19.6 U7.3(1Y0)
MCLK0_D: J5.6 U8.3(1Y0)
MCLK1_A: J2.4 U5.5(1Y1)
MCLK1_B: J6.4 U6.5(1Y1)
MCLK1_C: J10.4 U7.5(1Y1)
MCLK1_D: J14.4 U8.5(1Y1)
MCLK2_A: J3.4 U5.7(1Y2)
MCLK2_B: J7.4 U6.7(1Y2)
MCLK2_C: J11.4 U7.7(1Y2)
MCLK2_D: J15.4 U8.7(1Y2)
MCLK3_A: J1.6 U5.8(1Y3)
MCLK3_B: J18.6 U6.8(1Y3)
MCLK3_C: J20.6 U7.8(1Y3)
MCLK3_D: J8.6 U8.8(1Y3)
MUX_EN: CN7.9 U1.15(~E) U2.15(~E)
MUX_EN_B: CN9.1 MUX.6(E~) U3.15(~E) U4.15(~E)
N$3: C15.1 U$1.6(VBST)
N$7: R1.1 R2.2 U$1.4(VFB)
N$8: C15.2 L1.1 U$1.2(SW)
PSELECT: CN10.7 J1.4 J2.2 J3.2 J4.4 J5.4 J6.2 J7.2 J8.4 J10.2 J11.2 J14.2 J15.2 J17.4 J18.4 J19.4 J20.4
RESET: CN8.4 J1.16 J2.14 J3.14 J4.16 J5.16 J6.14 J7.14 J8.16 J10.14 J11.14 J14.14 J15.14 J17.16 J18.16 J19.16 J20.16
S0_M4A: CN10.1 MUX.10(S0)
S0_M16: CN7.1 U1.10(S0) U2.10(S0)
S0_M16_B: CN9.9 U3.10(S0) U4.10(S0)
S1_M4A: CN10.3 MUX.9(S1)
S1_M16: CN7.3 U1.11(S1) U2.11(S1)
S1_M16_B: CN9.10 U3.11(S1) U4.11(S1)
S2_M16: CN7.5 U1.14(S2) U2.14(S2)
S2_M16_B: CN9.7 U3.14(S2) U4.14(S2)
S3_M16: CN7.7 U1.13(S3) U2.13(S3)
S3_M16_B: CN9.5 U3.13(S3) U4.13(S3)
SCLK_1: CN10.4 J4.13 J6.11 J7.11 J10.11 J11.11 J18.13 J19.13 J20.13
SCLK_2: CN7.4 J1.11 J2.9 J3.9 J4.11 J6.9 J7.9 J17.11 J18.11
SCLK_3: CN8.2 J1.13 J2.11 J3.11 J5.13 J8.13 J14.11 J15.11 J17.13
SCLK_5: CN9.6 J5.11 J8.11 J10.9 J11.9 J14.9 J15.9 J19.11 J20.11
SDATA_1: CN10.6 J4.14 J6.12 J7.12 J10.12 J11.12 J18.14 J19.14 J20.14
SDATA_3: CN8.6 J1.14 J2.12 J3.12 J5.14 J8.14 J14.12 J15.12 J17.14
SDO_2: CN7.6 J1.9 J2.7 J3.7 J4.9 J6.7 J7.7 J17.9 J18.9 R68.2
SDO_5: CN9.4 J5.9 J8.9 J10.7 J11.7 J14.7 J15.7 J19.9 J20.9 R67.1
SLEEP: CN8.8 J1.15 J2.13 J3.13 J4.15 J5.15 J6.13 J7.13 J8.15 J10.13 J11.13 J14.13 J15.13 J17.15 J18.15 J19.15 J20.15
VIN: C11.1 C12.1 JP1.1 SJ1.1 U$1.3(VIN) U$1.5(EN)
Unconnected: CN7.10 CN8.1 CN8.3 CN8.5 CN9.2 CN10.2

## Notes on the sheet
- DISTRIBUTION BOARD (PART OF CONTROLLER BOARD)
- Buck converter (3.3V) | 1:64 MUX demultiplexer (used for SPI control select)
- 1:16 MUX (4x) | 1:4 MUX (1x)
- NAND gates used as NOT gates for voltage inversion 
  (CS is active low, demultiplexer outputs high)
- Only A pins are used
- VIN can be connected to 3.3V line with a solder jumper (if external 3.3V source is used)
- Clock distribution to DSP boards
- Clock crystal
  (used by DDS)
- Connected to DSP boards
- Connectors
- Connections to custom DSP boards | Holes
- Input voltage | Connections to NUCLEO-H743ZI2 board

## Library data of the parts
C1-C31 = rcl:C-EU: CAPACITOR, European symbol; SPICEPREFIX: C
CN7 CN9 = pinhead:PINHD-2X5: PIN HEADER
CN8 CN10 = pinhead:PINHD-2X4: PIN HEADER
CRYSTAL = ECX-H35CM-75.000:ECX-H35CM-75.000: low jitter, low current Frequency Configurable SMD crystal controlled oscillators.; AVAILABILITY: Unavailable; DESCRIPTION: Osc Xo 75.0000mhz Hcmos Smd; MF: ECS International; MP: ECX-H35CM-75.000; PACKAGE: SMD-6 ECS International; PRICE: None
H1 H2 = holes:MOUNT-HOLE: MOUNTING HOLE with drill center marker
J1 J4 J5 J8 J17-J20 = 61301421021_Eagle_WR-PHD_rev19a:6130XX243121_613016243121: WR-PHD 2.54 mm Angled Dual Socket Header ARTICLE PROPERTIES: Pins:4;​ 6;​ 8;​ 10;​ 12;​ 14;​ 16;​ 20;​ 22;​ 24;​ 26;​ 32;​ 34;​ 40;​ 64;​ 72 KIND PROPERTIES: Pitch：2.54 mm Quality Class:3 as per CECC 75 301-802 Rows：Dual Gender：Socket Header Type：Angled MATERIAL PROPERTIES: Insulator Material :PBT Insulator Flammability Rating:UL94 V-0 Contact Material:Copper Alloy Contact Plating:Gold Contact Type:Stamped GENERAL INFORMATION Operating Temperature:-40 up to +125 °C Compliance:Lead free / RoHS ELECTRICAL PROPERTIES: Rated Current:3 A Withstanding Voltage:500 V (AC) Contact Resistance:20 mΩ RISO:1000 MΩ CERTIFICATION UL Approval:E323964 PACKAGING PROPERTIES Packaging:Tray <https://katalog.we-online.com/media/images/v2/o33216v209%20Family_WR-PHD_6130xx243121.jpg> Details see: https://katalog.we-online.com/en/em/PHD_2_54_ANGLED_DUAL_SOCKET_HEADER_6130XX243121 Updated by Yingchun,Shan 2019-10-22 2019 (C) Würth Elektronik; DATASHEET-URL: https://katalog.we-online.com/em/datasheet/613016243121.pdf; GENDER: Socket Header; MATES: WR-PHD 2.54mm SMT Dual Pin Header/THT Angled Dual Pin Header/THT Dual Board Stacker/THT Dual Pin Header; PACKAGING: Tray; PART-NUMBER: 613016243121; PINS: 16; ROWS: Dual; TYPE: Angled
J2 J3 J6 J7 J10 J11 J14 J15 = 61301621021_Eagle_WR-PHD_rev19a:6130XX243121_613014243121: WR-PHD 2.54 mm Angled Dual Socket Header ARTICLE PROPERTIES: Pins:4;​ 6;​ 8;​ 10;​ 12;​ 14;​ 16;​ 20;​ 22;​ 24;​ 26;​ 32;​ 34;​ 40;​ 64;​ 72 KIND PROPERTIES: Pitch：2.54 mm Quality Class:3 as per CECC 75 301-802 Rows：Dual Gender：Socket Header Type：Angled MATERIAL PROPERTIES: Insulator Material :PBT Insulator Flammability Rating:UL94 V-0 Contact Material:Copper Alloy Contact Plating:Gold Contact Type:Stamped GENERAL INFORMATION Operating Temperature:-40 up to +125 °C Compliance:Lead free / RoHS ELECTRICAL PROPERTIES: Rated Current:3 A Withstanding Voltage:500 V (AC) Contact Resistance:20 mΩ RISO:1000 MΩ CERTIFICATION UL Approval:E323964 PACKAGING PROPERTIES Packaging:Tray <https://katalog.we-online.com/media/images/v2/o33216v209%20Family_WR-PHD_6130xx243121.jpg> Details see: https://katalog.we-online.com/en/em/PHD_2_54_ANGLED_DUAL_SOCKET_HEADER_6130XX243121 Updated by Yingchun,Shan 2019-10-22 2019 (C) Würth Elektronik; DATASHEET-URL: https://katalog.we-online.com/em/datasheet/613014243121.pdf; GENDER: Socket Header; MATES: WR-PHD 2.54mm SMT Dual Pin Header/THT Angled Dual Pin Header/THT Dual Board Stacker/THT Dual Pin Header; PACKAGING: Tray; PART-NUMBER: 613014243121; PINS: 14; ROWS: Dual; TYPE: Angled
JP1 = pinhead:PINHD-1X3: PIN HEADER
L1 = 7447773033_Eagle_WE-PD_rev19b:WE-PD_7345P: WE-PD SMT Power Inductor Characteristics AECQ 200 Qualified Ultra low RDC and RAC Highest possible saturation current based on Ferrite Suitable for switching frequency up to 10MHz Temperature dependent parameter available on Redexpert Operating Temperature from -40°C to +125°C / +150°C Types WE-PD: Since always with low loss material, tight tolerances and high saturation behavior compared to other manufacturers in the market WE-PD Robust: Plastic base improves the mechanical stability and efficiency WE-PD Performance: MnZn core improves Saturation and RDC for highest efficiency Applications Switch Mode Power supplies from 0,1W up to 300W Integrated DC DC Converter Ideal for Switch Mode Power supplies with extreme high efficiency (>95%) <https://katalog.we-online.com/media/images/v2/o14825v209%20Family_WE-PD.jpg> Details see: https://katalog.we-online.com/en/pbs/WE-PD Updated by Yingchun,Shan 2019-07-25 2019 (C) Wurth Elektronik; DATASHEET-URL: https://www.we-online.com/catalog/datasheet/7447773033.pdf; FRES: 51MHz; IR: 4.3A; ISAT: 6.6A; MOUNT: SMT; PART-NUMBER: 7447773033; RDC-MAX: 21mOhm; RDC-TYP: 15.5mOhm; VERSION: Performance
MUX = SOIC127P600X175-16N:CD74HC4052M96
R1-R68 = rcl:R-EU_: RESISTOR, European symbol; SPICEPREFIX: R
SJ1 = jumper:SJ: SMD solder JUMPER
U1-U4 = CD74HC4067SM96:CD74HC4067SM96: 16-Channel Analog Multiplexer/Demultiplexer; AVAILABILITY: Unavailable; DESCRIPTION: 1 Circuit IC Switch 16:1 160Ohm 24-SSOP; MF: Texas Instruments; MP: CD74HC4067SM96; PACKAGE: SSOP-24 Texas Instruments; PRICE: None
U5-U8 = CDCV304PW:CDCV304PW: 200MHZ GENERAL PURPOSE CLOCK BUFFER; AVAILABILITY: Unavailable; DESCRIPTION: Clock Fanout Buffer _Distribution_ IC 1:4 200MHz 8-TSSOP _0.173, 4.40mm Width_; MF: Texas Instruments; MP: CDCV304PW; PACKAGE: TSSOP-8 Texas Instruments; PRICE: None
U9-U24 = SN74LV00ADGVR:SN74LV00ADGVR: Quadruple 2-Input Positive-NAND Gates 14-TVSOP -40 to 125; AVAILABILITY: Unavailable; DESCRIPTION: Quadruple 2-Input Positive-NAND Gates 14-TVSOP -40 to 125; MF: Texas Instruments; MP: SN74LV00ADGVR; PACKAGE: TVSOP-14 Texas Instruments; PRICE: None
U$1 = SOT95P280X110-6N:TPS562209